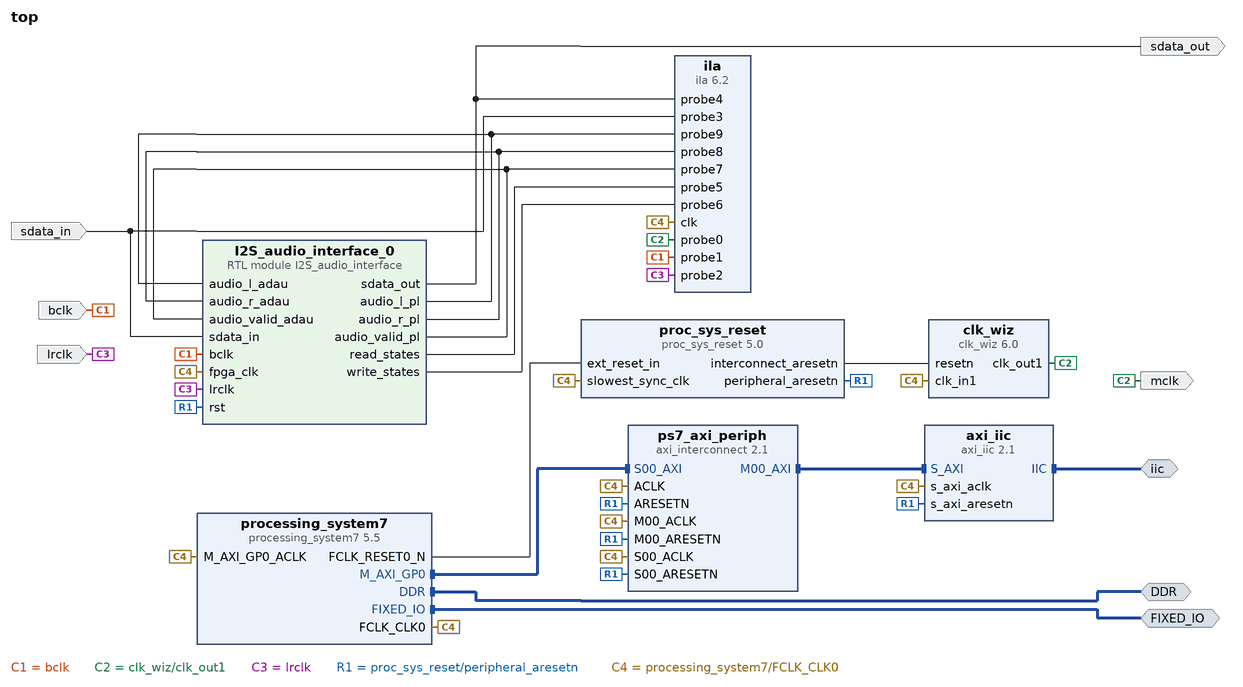
[diagram p0: block diagram of the top level]
# Vivado block design top, xc7z020clg484-1, Vivado 2021.2
create_bd_design top

create_bd_intf_port -mode Master -vlnv xilinx.com:interface:ddrx_rtl:1.0 DDR
create_bd_intf_port -mode Master -vlnv xilinx.com:display_processing_system7:fixedio_rtl:1.0 FIXED_IO
create_bd_intf_port -mode Master -vlnv xilinx.com:interface:iic_rtl:1.0 iic
create_bd_port -dir O -type clk mclk
set_property -dict {CONFIG.FREQ_HZ 12288000} [get_bd_ports mclk]
create_bd_port -dir I bclk
create_bd_port -dir I lrclk
create_bd_port -dir I sdata_in
create_bd_port -dir O sdata_out

create_bd_cell -type ip -vlnv xilinx.com:ip:axi_iic:2.1 axi_iic
create_bd_cell -type ip -vlnv xilinx.com:ip:clk_wiz:6.0 clk_wiz
set_property -dict [list \
  CONFIG.CLKOUT1_JITTER 360.948 \
  CONFIG.CLKOUT1_PHASE_ERROR 301.601 \
  CONFIG.CLKOUT1_REQUESTED_OUT_FREQ 12.288 \
  CONFIG.MMCM_CLKFBOUT_MULT_F 48.000 \
  CONFIG.MMCM_CLKOUT0_DIVIDE_F 78.125 \
  CONFIG.MMCM_DIVCLK_DIVIDE 5 \
  CONFIG.RESET_PORT resetn \
  CONFIG.RESET_TYPE ACTIVE_LOW \
] [get_bd_cells clk_wiz]
create_bd_cell -type ip -vlnv xilinx.com:ip:ila:6.2 ila
set_property -dict [list \
  CONFIG.C_DATA_DEPTH 16384 \
  CONFIG.C_ENABLE_ILA_AXI_MON false \
  CONFIG.C_INPUT_PIPE_STAGES 2 \
  CONFIG.C_MONITOR_TYPE Native \
  CONFIG.C_NUM_OF_PROBES 10 \
] [get_bd_cells ila]
create_bd_cell -type ip -vlnv xilinx.com:ip:proc_sys_reset:5.0 proc_sys_reset
create_bd_cell -type ip -vlnv xilinx.com:ip:processing_system7:5.5 processing_system7
set_property -dict [list \
  CONFIG.PCW_APU_PERIPHERAL_FREQMHZ 666.666667 \
  CONFIG.PCW_ENET0_ENET0_IO {MIO 16 .. 27} \
  CONFIG.PCW_ENET0_GRP_MDIO_ENABLE 1 \
  CONFIG.PCW_ENET0_GRP_MDIO_IO {MIO 52 .. 53} \
  CONFIG.PCW_ENET0_PERIPHERAL_ENABLE 1 \
  CONFIG.PCW_ENET0_RESET_ENABLE 0 \
  CONFIG.PCW_ENET_RESET_ENABLE 1 \
  CONFIG.PCW_ENET_RESET_SELECT {Share reset pin} \
  CONFIG.PCW_FPGA0_PERIPHERAL_FREQMHZ 100.000000 \
  CONFIG.PCW_FPGA1_PERIPHERAL_FREQMHZ 150.000000 \
  CONFIG.PCW_FPGA2_PERIPHERAL_FREQMHZ 50.000000 \
  CONFIG.PCW_GPIO_MIO_GPIO_ENABLE 1 \
  CONFIG.PCW_GPIO_MIO_GPIO_IO MIO \
  CONFIG.PCW_I2C_RESET_ENABLE 1 \
  CONFIG.PCW_PERIPHERAL_BOARD_PRESET part0 \
  CONFIG.PCW_PRESET_BANK1_VOLTAGE {LVCMOS 1.8V} \
  CONFIG.PCW_QSPI_GRP_SINGLE_SS_ENABLE 1 \
  CONFIG.PCW_QSPI_GRP_SINGLE_SS_IO {MIO 1 .. 6} \
  CONFIG.PCW_QSPI_PERIPHERAL_ENABLE 1 \
  CONFIG.PCW_QSPI_PERIPHERAL_FREQMHZ 200.000000 \
  CONFIG.PCW_QSPI_QSPI_IO {MIO 1 .. 6} \
  CONFIG.PCW_SD0_GRP_CD_ENABLE 1 \
  CONFIG.PCW_SD0_GRP_CD_IO {MIO 47} \
  CONFIG.PCW_SD0_GRP_WP_ENABLE 1 \
  CONFIG.PCW_SD0_GRP_WP_IO {MIO 46} \
  CONFIG.PCW_SD0_PERIPHERAL_ENABLE 1 \
  CONFIG.PCW_SD0_SD0_IO {MIO 40 .. 45} \
  CONFIG.PCW_SDIO_PERIPHERAL_FREQMHZ 50 \
  CONFIG.PCW_SINGLE_QSPI_DATA_MODE x4 \
  CONFIG.PCW_TTC0_PERIPHERAL_ENABLE 1 \
  CONFIG.PCW_TTC0_TTC0_IO EMIO \
  CONFIG.PCW_UART1_PERIPHERAL_ENABLE 1 \
  CONFIG.PCW_UART1_UART1_IO {MIO 48 .. 49} \
  CONFIG.PCW_UART_PERIPHERAL_FREQMHZ 50 \
  CONFIG.PCW_UIPARAM_DDR_FREQ_MHZ 533.333313 \
  CONFIG.PCW_UIPARAM_DDR_PARTNO {MT41J128M16 HA-15E} \
  CONFIG.PCW_USB0_PERIPHERAL_ENABLE 1 \
  CONFIG.PCW_USB0_RESET_ENABLE 0 \
  CONFIG.PCW_USB0_USB0_IO {MIO 28 .. 39} \
  CONFIG.PCW_USB_RESET_ENABLE 1 \
  CONFIG.PCW_USB_RESET_SELECT {Share reset pin} \
  CONFIG.preset ZedBoard \
] [get_bd_cells processing_system7]
# 500 more settings of processing_system7 are not shown: defaults, MIO pin electricals, DDR timing, and values the tool derives
create_bd_cell -type ip -vlnv xilinx.com:ip:axi_interconnect:2.1 ps7_axi_periph
set_property -dict {CONFIG.NUM_MI 1} [get_bd_cells ps7_axi_periph]
create_bd_cell -type module -reference I2S_audio_interface I2S_audio_interface_0

# ---- connections ----

connect_bd_intf_net [get_bd_intf_ports iic] [get_bd_intf_pins axi_iic/IIC]
connect_bd_intf_net [get_bd_intf_ports DDR] [get_bd_intf_pins processing_system7/DDR]
connect_bd_intf_net [get_bd_intf_ports FIXED_IO] [get_bd_intf_pins processing_system7/FIXED_IO]
connect_bd_intf_net [get_bd_intf_pins processing_system7/M_AXI_GP0] [get_bd_intf_pins ps7_axi_periph/S00_AXI]
connect_bd_intf_net [get_bd_intf_pins ps7_axi_periph/M00_AXI] [get_bd_intf_pins axi_iic/S_AXI]
connect_bd_net [get_bd_pins I2S_audio_interface_0/audio_l_pl] [get_bd_pins I2S_audio_interface_0/audio_l_adau] [get_bd_pins ila/probe9]
connect_bd_net [get_bd_pins I2S_audio_interface_0/audio_r_pl] [get_bd_pins I2S_audio_interface_0/audio_r_adau] [get_bd_pins ila/probe8]
connect_bd_net [get_bd_pins I2S_audio_interface_0/audio_valid_pl] [get_bd_pins I2S_audio_interface_0/audio_valid_adau] [get_bd_pins ila/probe7]
connect_bd_net [get_bd_pins I2S_audio_interface_0/read_states] [get_bd_pins ila/probe5]
connect_bd_net [get_bd_pins I2S_audio_interface_0/sdata_out] [get_bd_ports sdata_out] [get_bd_pins ila/probe4]
connect_bd_net [get_bd_pins I2S_audio_interface_0/write_states] [get_bd_pins ila/probe6]
connect_bd_net [get_bd_ports bclk] [get_bd_pins ila/probe1] [get_bd_pins I2S_audio_interface_0/bclk]
connect_bd_net [get_bd_pins clk_wiz/clk_out1] [get_bd_ports mclk] [get_bd_pins ila/probe0]
connect_bd_net [get_bd_ports lrclk] [get_bd_pins ila/probe2] [get_bd_pins I2S_audio_interface_0/lrclk]
connect_bd_net [get_bd_pins proc_sys_reset/interconnect_aresetn] [get_bd_pins clk_wiz/resetn]
connect_bd_net [get_bd_pins proc_sys_reset/peripheral_aresetn] \
  [get_bd_pins axi_iic/s_axi_aresetn] [get_bd_pins ps7_axi_periph/ARESETN] [get_bd_pins ps7_axi_periph/S00_ARESETN] \
  [get_bd_pins ps7_axi_periph/M00_ARESETN] [get_bd_pins I2S_audio_interface_0/rst]
connect_bd_net [get_bd_pins processing_system7/FCLK_CLK0] \
  [get_bd_pins axi_iic/s_axi_aclk] [get_bd_pins clk_wiz/clk_in1] [get_bd_pins ila/clk] \
  [get_bd_pins proc_sys_reset/slowest_sync_clk] [get_bd_pins processing_system7/M_AXI_GP0_ACLK] \
  [get_bd_pins ps7_axi_periph/ACLK] [get_bd_pins ps7_axi_periph/S00_ACLK] [get_bd_pins ps7_axi_periph/M00_ACLK] \
  [get_bd_pins I2S_audio_interface_0/fpga_clk]
connect_bd_net [get_bd_pins processing_system7/FCLK_RESET0_N] [get_bd_pins proc_sys_reset/ext_reset_in]
connect_bd_net [get_bd_ports sdata_in] [get_bd_pins ila/probe3] [get_bd_pins I2S_audio_interface_0/sdata_in]

# ---- address map ----
assign_bd_address -offset 0x41600000 -range 64K -target_address_space [get_bd_addr_spaces processing_system7/Data] [get_bd_addr_segs axi_iic/S_AXI/Reg]

validate_bd_design
save_bd_design
